# Altium schematic sheet 2014_AlimBeaconEye.SchDoc
size A4
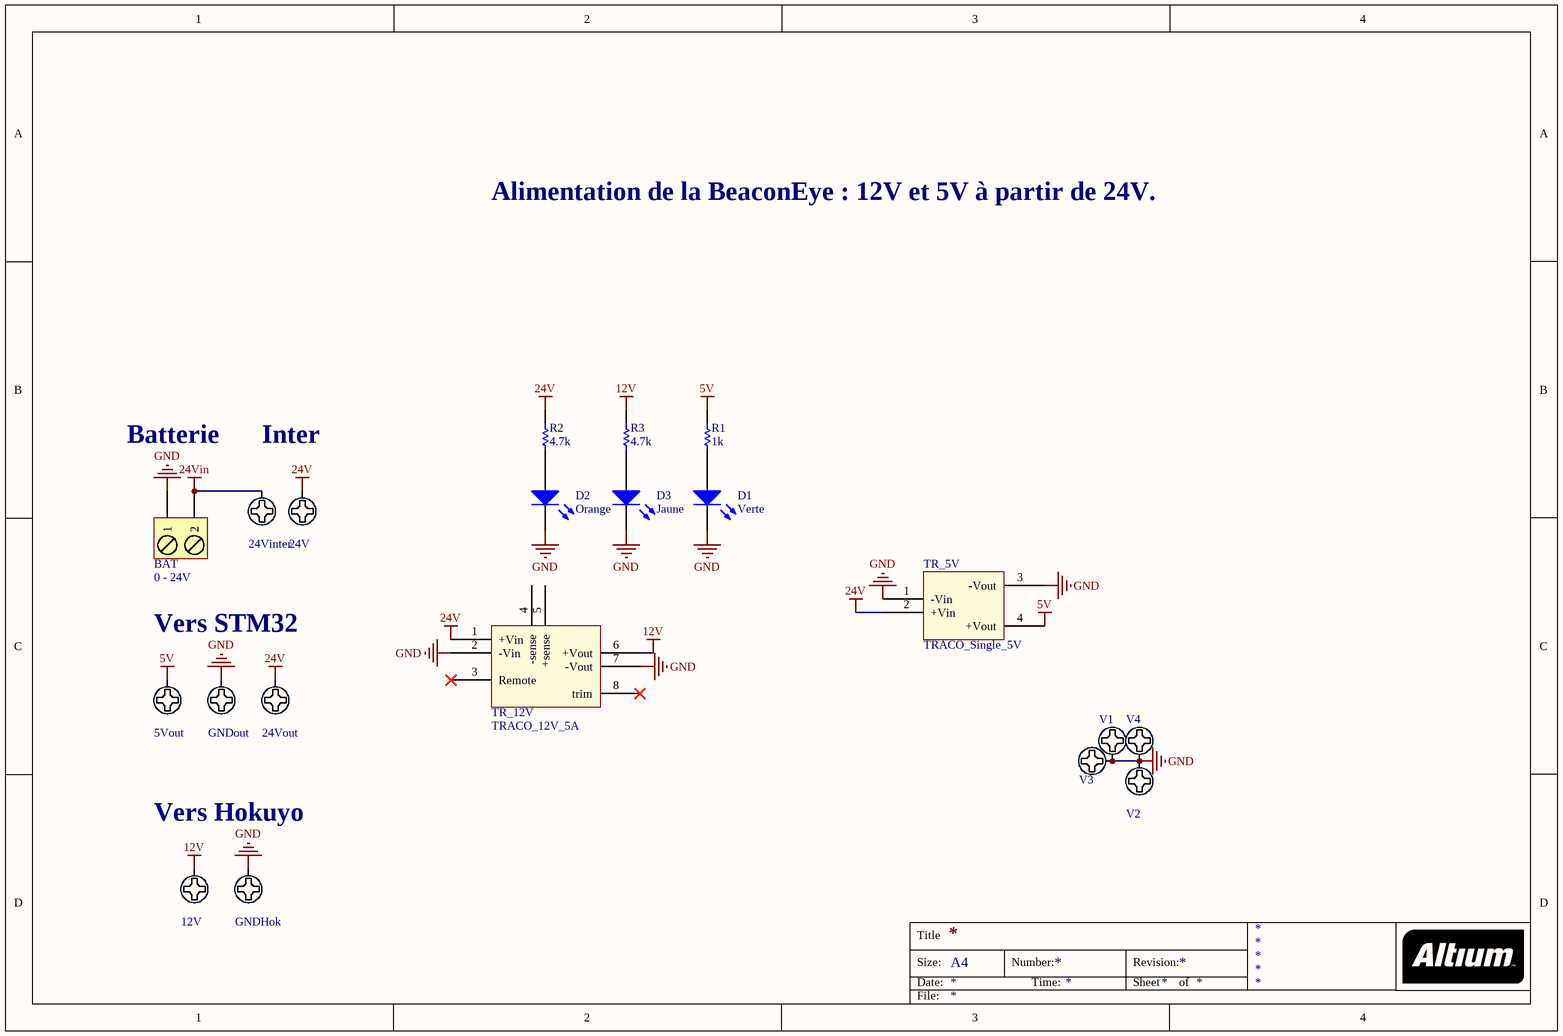
[diagram p0: 2014_AlimBeaconEye.SchDoc]

## Parts
5Vout  Pad_M3  [M3x6mm]  (value not drawn)
12V  Pad_M3  [M3x6mm]  (value not drawn)
24V  Pad_M3  [M3x6mm]  (value not drawn)
24Vinter  Pad_M3  [M3x6mm]  (value not drawn)
24Vout  Pad_M3  [M3x6mm]  (value not drawn)
BAT  0 - 24V  [BORNIER2_FEM_COUDE]
D1  Verte  [LED_0805]
D2  Orange  [LED_0805]
D3  Jaune  [LED_0805]
GNDHok  Pad_M3  [M3x6mm]  (value not drawn)
GNDout  Pad_M3  [M3x6mm]  (value not drawn)
R1  1k  [R1206_N]
R2  4.7k  [R1206_N]
R3  4.7k  [R1206_N]
TR_5V  TRACO_Single_5V  [TRACO_Single]
TR_12V  TRACO_12V_5A  [TRACO_SIMPLE_12V_5A]
V1  Pad_M3  [M3x6mm]  (value not drawn)
V2  Pad_M3  [M3x6mm]  (value not drawn)
V3  Pad_M3  [M3x6mm]  (value not drawn)
V4  Pad_M3  [M3x6mm]  (value not drawn)

## Nets
5V: 5Vout.1 R1.1 TR_5V.4(+Vout)
12V: 12V.1 R3.1 TR_12V.6(+Vout)
24V: 24V.1 24Vout.1 R2.1 TR_5V.2(+Vin) TR_12V.1(+Vin)
24Vin: 24Vinter.1 BAT.2
GND: BAT.1 D1.2(K) D2.2(K) D3.2(K) GNDHok.1 GNDout.1 TR_5V.1(-Vin) TR_5V.3(-Vout) TR_12V.2(-Vin) TR_12V.7(-Vout) V1.1 V2.1 V3.1 V4.1
NetD1_1: D1.1(A) R1.2
NetD2_1: D2.1(A) R2.2
NetD3_1: D3.1(A) R3.2

Not connected (* = marked no-connect by the designer): TR_12V 3(Remote)* 4(-sense) 5(+sense) 8(trim)

## Notes on the sheet
- Alimentation de la BeaconEye : 12V et 5V à partir de 24V.
- Batterie
- Inter
- Vers STM32
- Vers Hokuyo
- Title
- Size:
- Date:
- A4
- Number:
- Time:
- Revision:
- Sheet
- of
- File:

## Library data of the parts
5Vout 12V 24V 24Vinter 24Vout GNDHok GNDout V1-V4 = Vis M3 X 6mm _TORX_Tête 6mm: Publisher: Damien Guitton
BAT = BORNIER2: Terminal blocks, 2 pins, pitch=5mm
D1-D3 = LED: Typical LED; Published: 8-Jun-2000; LatestRevisionDate: 08-Jul-2005; LatestRevisionNote: Mech Layer 1 removed.; PackageReference: LED-1; Publisher: Altium Limited
R1-R3 = Resistor: Published: 8-Jun-2000; LatestRevisionDate: 17-Jul-2002; LatestRevisionNote: Re-released for DXP Platform.; PackageReference: AXIAL-0.5; Publisher: Altium Limited
TR_5V = TRACO_Single